# EAGLE design monojoystick-ioboard (EAGLE 5.06)

## Sheet 1 of 2
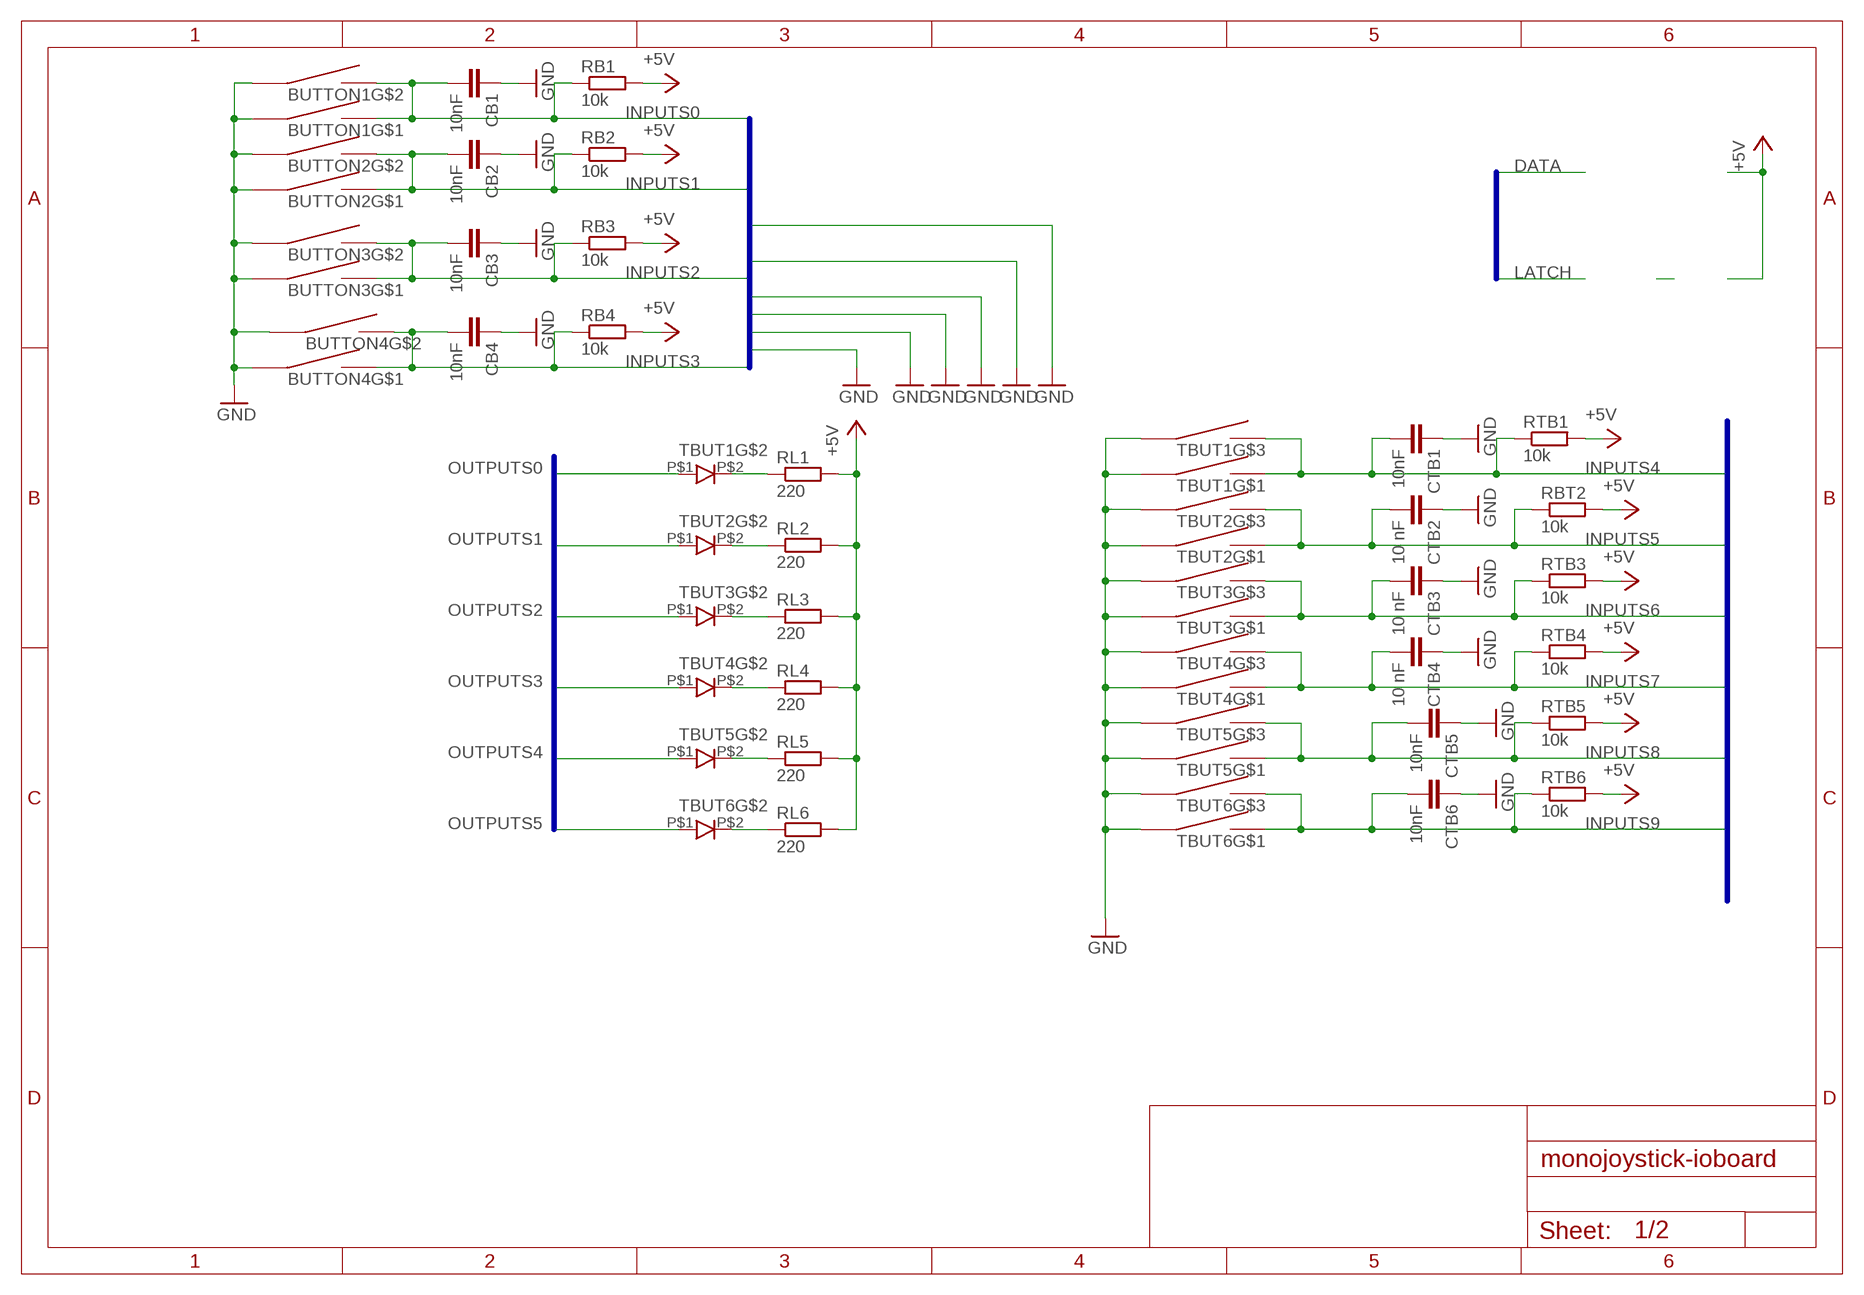
[diagram p0: schematic, sheet 1]

### Parts
BUTTON1  3FTL  [3FTL06]
BUTTON2  3FTL  [3FTL06]
BUTTON3  3FTL  [3FTL06]
BUTTON4  3FTL  [3FTL06]
CB1  10nF  C-EUC0805  [C0805]
CB2  10nF  C-EUC0805  [C0805]
CB3  10nF  C-EUC0805  [C0805]
CB4  10nF  C-EUC0805  [C0805]
CTB1  10nF  C-EUC0805  [C0805]
CTB2  10 nF  C-EUC0805  [C0805]
CTB3  10 nF  C-EUC0805  [C0805]
CTB4  10 nF  C-EUC0805  [C0805]
CTB5  10nF  C-EUC0805  [C0805]
CTB6  10nF  C-EUC0805  [C0805]
RB1  10k  R-EU_R0805  [R0805]
RB2  10k  R-EU_R0805  [R0805]
RB3  10k  R-EU_R0805  [R0805]
RB4  10k  R-EU_R0805  [R0805]
RBT2  10k  R-EU_R0805  [R0805]
RL1  220  R-EU_R0805  [R0805]
RL2  220  R-EU_R0805  [R0805]
RL3  220  R-EU_R0805  [R0805]
RL4  220  R-EU_R0805  [R0805]
RL5  220  R-EU_R0805  [R0805]
RL6  220  R-EU_R0805  [R0805]
RTB1  10k  R-EU_R0805  [R0805]
RTB3  10k  R-EU_R0805  [R0805]
RTB4  10k  R-EU_R0805  [R0805]
RTB5  10k  R-EU_R0805  [R0805]
RTB6  10k  R-EU_R0805  [R0805]
TBUT1  3FTL-LED  [3FTL06-LED]
TBUT2  3FTL-LED  [3FTL06-LED]
TBUT3  3FTL-LED  [3FTL06-LED]
TBUT4  3FTL-LED  [3FTL06-LED]
TBUT5  3FTL-LED  [3FTL06-LED]
TBUT6  3FTL-LED  [3FTL06-LED]

### Nets
GND: BUTTON1.A@1 BUTTON1.A@2 BUTTON2.A@1 BUTTON2.A@2 BUTTON3.A@1 BUTTON3.A@2 BUTTON4.A@1 BUTTON4.A@2 CB1.1 CB2.1 CB3.1 CB4.1 CTB1.1 CTB2.1 CTB3.1 CTB4.1 CTB5.1 CTB6.1 TBUT1.A@1 TBUT1.B@1 TBUT2.A@1 TBUT2.B@1 TBUT3.A@1 TBUT3.B@1 TBUT4.A@1 TBUT4.B@1 TBUT5.A@1 TBUT5.B@1 TBUT6.A@1 TBUT6.B@1 ; also sheet 2
INPUTS0: BUTTON1.B@1 BUTTON1.B@2 CB1.2 RB1.1 ; also sheet 2
INPUTS1: BUTTON2.B@1 BUTTON2.B@2 CB2.2 RB2.1 ; also sheet 2
INPUTS2: BUTTON3.B@1 BUTTON3.B@2 CB3.2 RB3.1 ; also sheet 2
INPUTS3: BUTTON4.B@1 BUTTON4.B@2 CB4.2 RB4.1 ; also sheet 2
INPUTS4: CTB1.2 RTB1.1 TBUT1.A@2 TBUT1.B@2 ; also sheet 2
INPUTS5: CTB2.2 RBT2.1 TBUT2.A@2 TBUT2.B@2 ; also sheet 2
INPUTS6: CTB3.2 RTB3.1 TBUT3.A@2 TBUT3.B@2 ; also sheet 2
INPUTS7: CTB4.2 RTB4.1 TBUT4.A@2 TBUT4.B@2 ; also sheet 2
INPUTS8: CTB5.2 RTB5.1 TBUT5.A@2 TBUT5.B@2 ; also sheet 2
INPUTS9: CTB6.2 RTB6.1 TBUT6.A@2 TBUT6.B@2 ; also sheet 2
N$6: RL5.1 TBUT5.P$2
N$7: RL4.1 TBUT4.P$2
N$8: RL6.1 TBUT6.P$2
N$9: RL1.1 TBUT1.P$2
N$10: RL2.1 TBUT2.P$2
N$11: RL3.1 TBUT3.P$2
OUTPUTS0: TBUT1.P$1 ; also sheet 2
OUTPUTS1: TBUT2.P$1 ; also sheet 2
OUTPUTS2: TBUT3.P$1 ; also sheet 2
OUTPUTS3: TBUT4.P$1 ; also sheet 2
OUTPUTS4: TBUT5.P$1 ; also sheet 2
OUTPUTS5: TBUT6.P$1 ; also sheet 2
VCC: RB1.2 RB2.2 RB3.2 RB4.2 RBT2.2 RL1.2 RL2.2 RL3.2 RL4.2 RL5.2 RL6.2 RTB1.2 RTB3.2 RTB4.2 RTB5.2 RTB6.2 ; supply symbol labelled +5V ; also sheet 2

### Buses
INPUTS[0..31]
LED1,LED2
OUTPUTS[0..8]

## Sheet 2 of 2
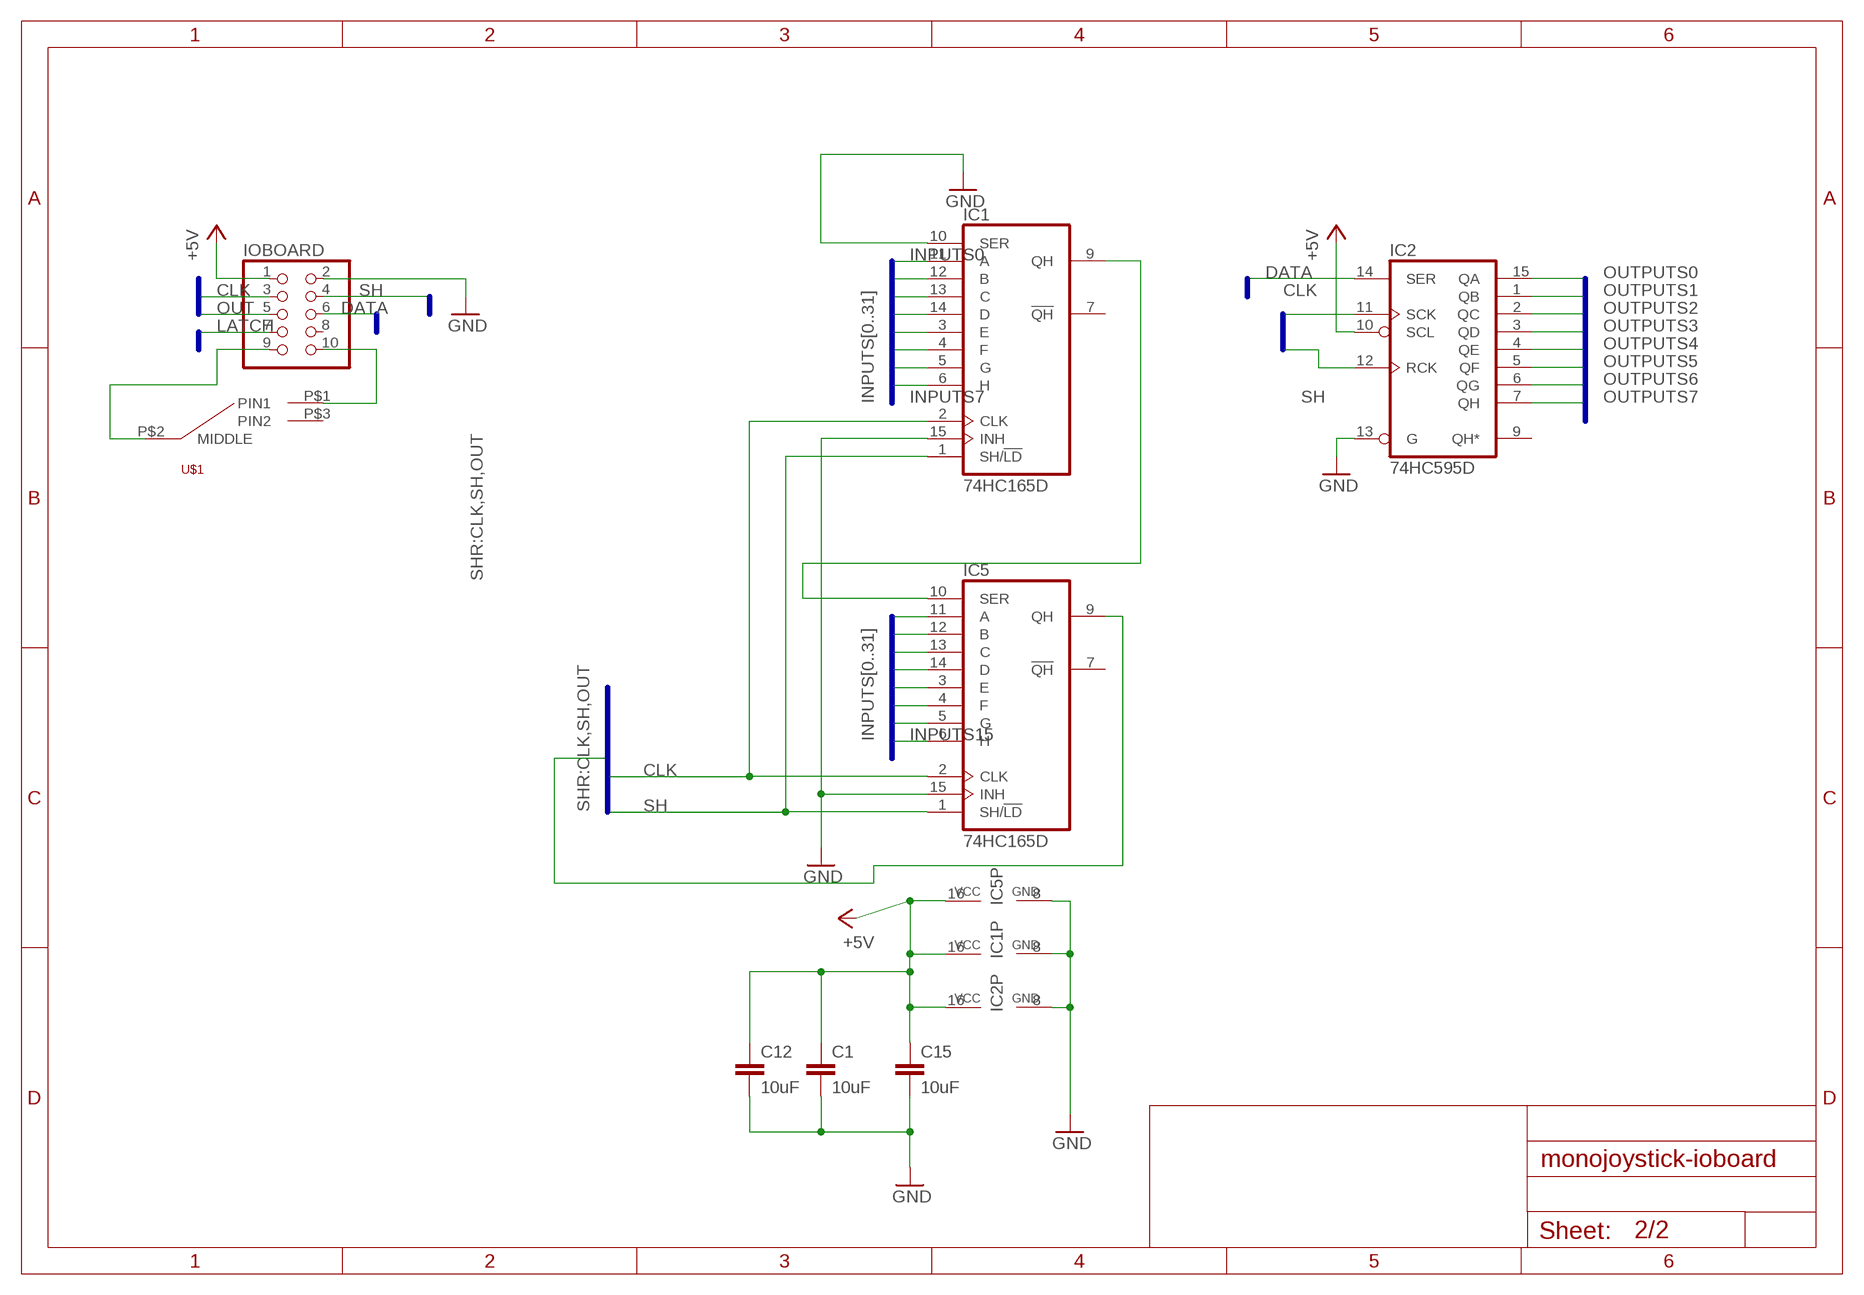
[diagram p1: schematic, sheet 2]

### Parts
C1  10uF  C-EUC0805  [C0805]
C12  10uF  C-EUC0805  [C0805]
C15  10uF  C-EUC0805  [C0805]
IC1  74HC165D  [SO16]
IC2  74HC595D  [SO16]
IC5  74HC165D  [SO16]
IOBOARD  PINHD-2X5  [2X05]
U$1  POWER  [POWER]

### Nets
CLK: IC1.2(CLK) IC2.11(SCK) IC5.2(CLK) IOBOARD.3
DATA: IC2.14(SER) IOBOARD.6 ; also sheet 1
GND: C1.2 C12.2 C15.2 IC1.8(GND) IC1.10(SER) IC1.15(INH) IC2.8(GND) IC2.13(G) IC5.8(GND) IC5.15(INH) IOBOARD.2 ; also sheet 1
INPUTS0: IC1.11(A) ; also sheet 1
INPUTS1: IC1.12(B) ; also sheet 1
INPUTS2: IC1.13(C) ; also sheet 1
INPUTS3: IC1.14(D) ; also sheet 1
INPUTS4: IC1.3(E) ; also sheet 1
INPUTS5: IC1.4(F) ; also sheet 1
INPUTS6: IC1.5(G) ; also sheet 1
INPUTS7: IC1.6(H) ; also sheet 1
INPUTS8: IC5.11(A) ; also sheet 1
INPUTS9: IC5.12(B) ; also sheet 1
INPUTS10: IC5.13(C)
INPUTS11: IC5.14(D)
INPUTS12: IC5.3(E)
INPUTS13: IC5.4(F)
INPUTS14: IC5.5(G)
INPUTS15: IC5.6(H) ; also sheet 1
LATCH: IOBOARD.7 ; also sheet 1
N$1: IC1.9(QH) IC5.10(SER)
N$4: IOBOARD.9 U$1.P$2(MIDDLE)
N$5: IOBOARD.10 U$1.P$1(PIN1)
OUT: IC5.9(QH) IOBOARD.5
OUTPUTS0: IC2.15(QA) ; also sheet 1
OUTPUTS1: IC2.1(QB) ; also sheet 1
OUTPUTS2: IC2.2(QC) ; also sheet 1
OUTPUTS3: IC2.3(QD) ; also sheet 1
OUTPUTS4: IC2.4(QE) ; also sheet 1
OUTPUTS5: IC2.5(QF) ; also sheet 1
OUTPUTS6: IC2.6(QG)
OUTPUTS7: IC2.7(QH)
SH: IC1.1(SH/!LD) IC2.12(RCK) IC5.1(SH/!LD) IOBOARD.4
VCC: C1.1 C12.1 C15.1 IC1.16(VCC) IC2.10(SCL) IC2.16(VCC) IC5.16(VCC) IOBOARD.1 ; supply symbol labelled +5V ; also sheet 1
Unconnected: IC1.7(!QH) IC2.9(QH*) IC5.7(!QH) IOBOARD.8 U$1.P$3(PIN2)

### Buses
INPUTS[0..31]
SHR:CLK,SH,OUT
LED1,LED2
OUTPUTS[0..8]

## Library data of the parts
BUTTON1-BUTTON4 = ruinwesen:3FTL; FRONTPLATE: yes; MECHANICAL: yes
C1 C12 C15 CB1-CB4 CTB1-CTB6 = rcl:C-EU: CAPACITOR, European symbol
IC1 IC5 = 74xx-eu:74*165: 8-bit parallel load SHIFT REGISTER
IC2 = 74xx-eu:74*595: 8-bit SHIFT REGISTER, output latch
IOBOARD = pinhead:PINHD-2X5: PIN HEADER
RB1-RB4 RBT2 RL1-RL6 RTB1 RTB3-RTB6 = rcl:R-EU_: RESISTOR, European symbol
TBUT1-TBUT6 = ruinwesen:3FTL-LED; FRONTPLATE: yes
U$1 = ruinwesen:POWER

## Board
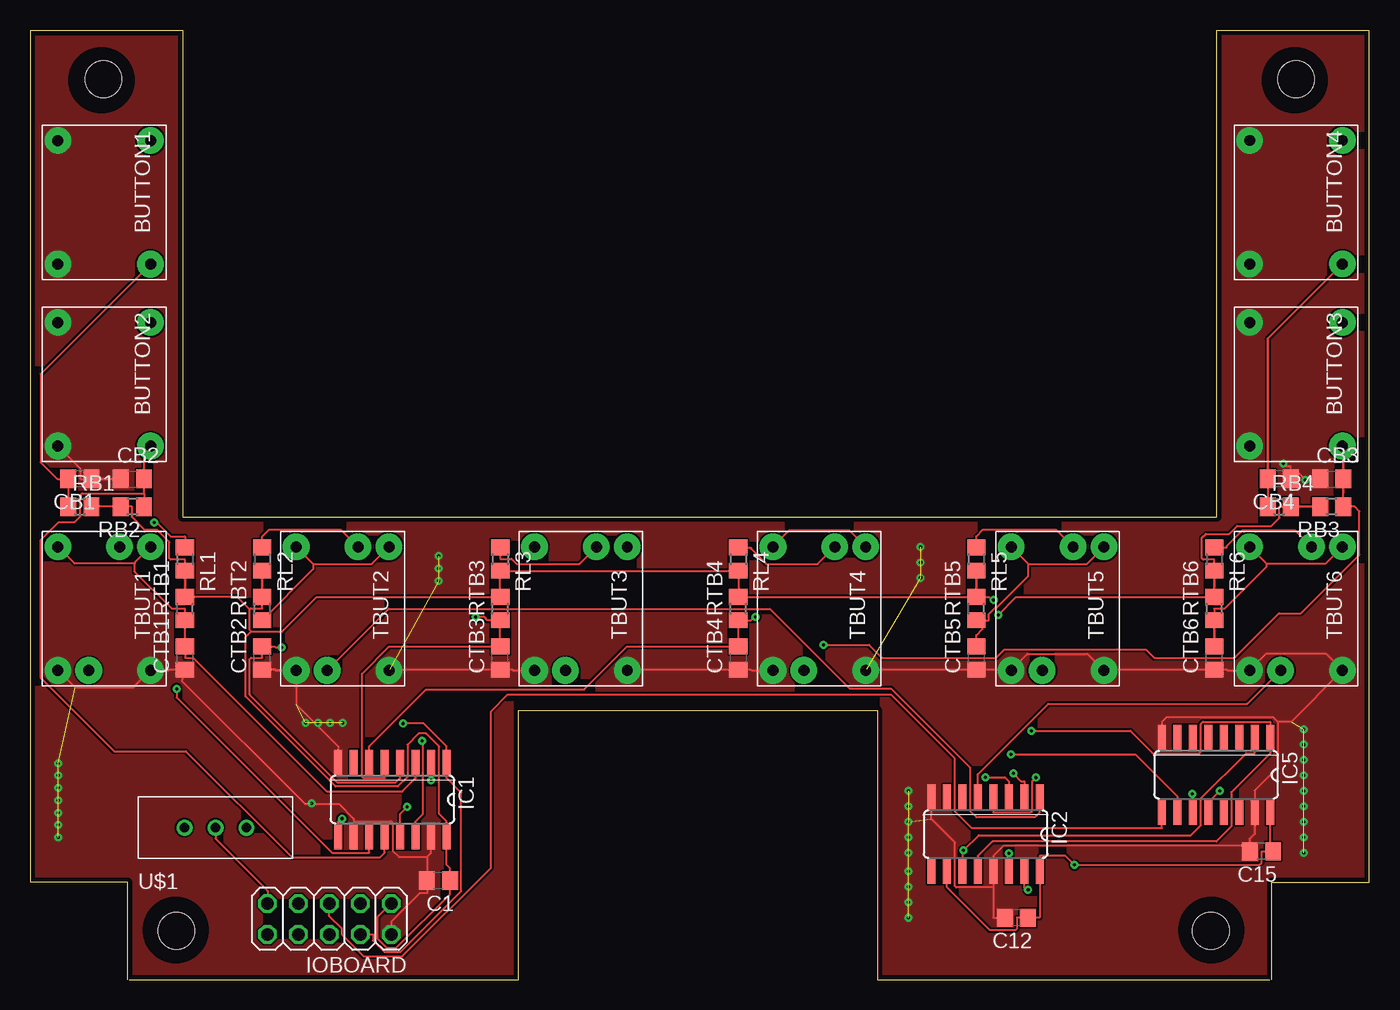
[diagram p2: board, top side]
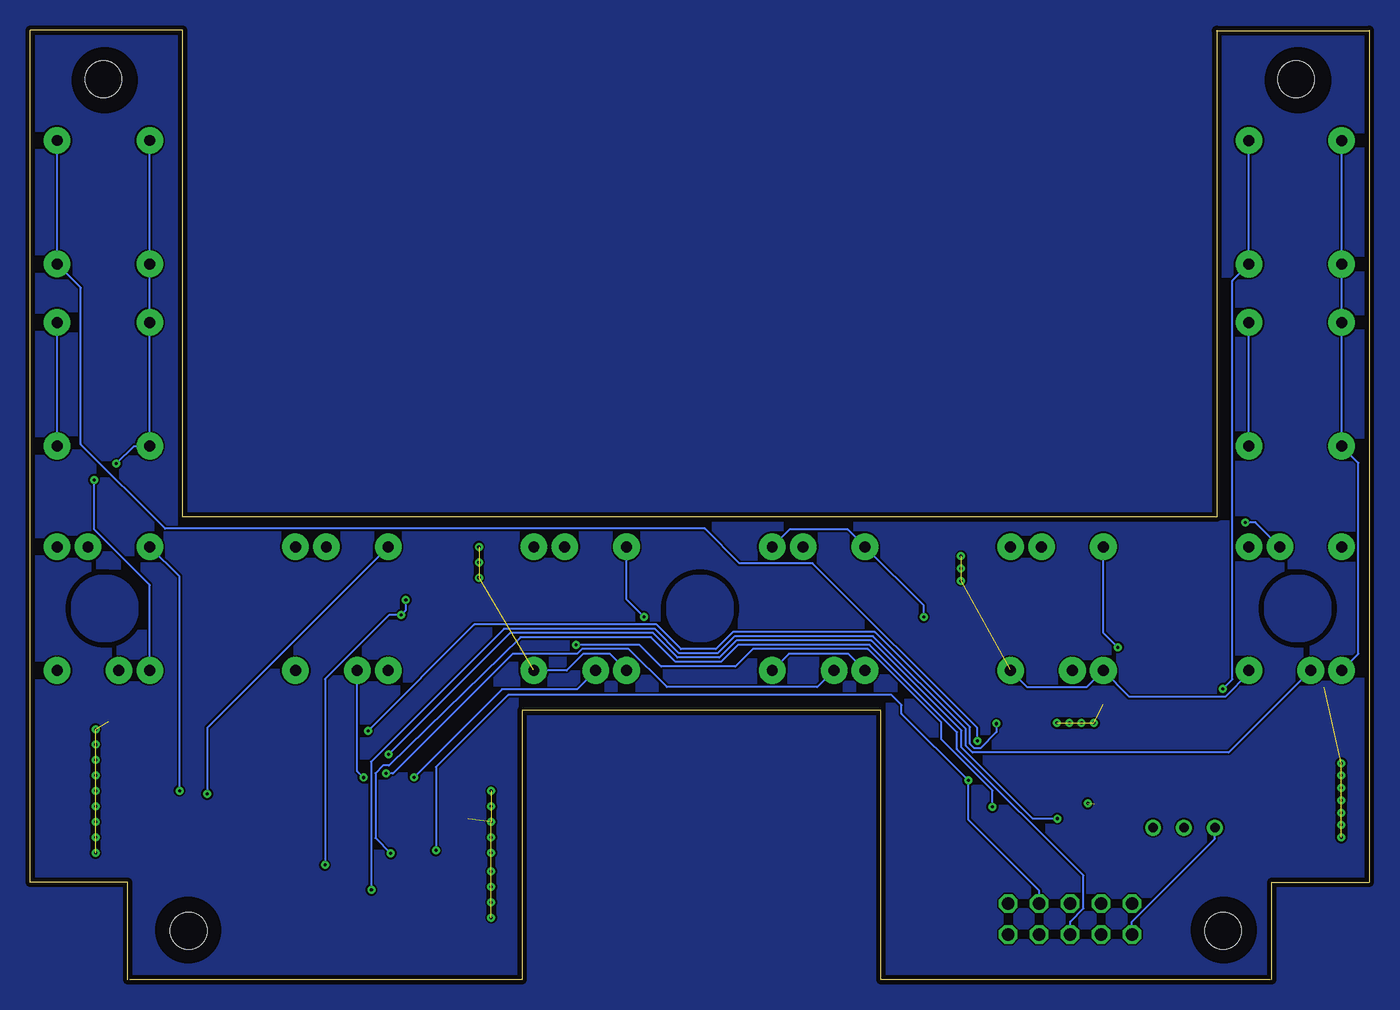
[diagram p3: board, bottom side, seen from below]

Size 110 x 78 mm. Coordinates in mm from the lower left corner, seen from the top.
Outline: 0,78 0,77.98
Outline: 0,77.98 0,8 8,8 8,0
Outline: 102,0 102,8 110,8 110,78 97.49,78 97.49,38.03 12.51,38.03 12.51,78
Outline: 12.55,77.98 0,77.98
Outline: 8.13,0 40.13,0 40.13,22.1 69.6,22.1 69.6,0 101.85,0
Copper layers (1*16): Top 0.035mm / dielectric 1.5mm / Bottom 0.035mm
Design rules "default *": minimum track width 0.15mm, minimum drill 0.25mm, track to track 0.15mm, track to pad 0.15mm, pad to pad 0.15mm, via to via 0.15mm, smd to smd 0.15mm, copper to edge 0.4mm, drill to drill 8mil, minimum pad ring 10mil, minimum via ring 8mil, stop-mask expansion 4mil, vias tented up to drill 0mil, thermal gap 10mil
Holes 3 mm at 6,74 104,74 12,4 97,4
tRestrict: area 9.4,1.5 to 14.5,6.6; area 94.5,1.5 to 99.5,6.6; area 101.4,71.4 to 106.4,76.4; area 3.3,71.4 to 8.4,76.4
bRestrict: area 9.4,1.5 to 14.5,6.6; area 2.8,27.5 to 8.8,33.5; area 94.5,1.5 to 99.5,6.6; area 100.9,27.5 to 106.9,33.5; area 101.4,71.4 to 106.4,76.4; area 3.3,71.4 to 8.4,76.4; area 52,27.5 to 58,33.5

### Footprints (pad centres in the part's own frame; a part is rotated, then mirrored left to right if it is on the bottom)
3FTL06 = drill 0.9 pad 2.184 round: A@1 -5.08,3.81; A@2 5.08,3.81; B@1 -5.08,-3.81; B@2 5.08,-3.81
C0805 = smd 1.3 x 1.5: 1 -0.95,0; 2 0.95,0
SO16 = smd 0.66 x 2.032: 1 -4.445,-3.073; 2 -3.175,-3.073; 3 -1.905,-3.073; 4 -0.635,-3.073; 5 0.635,-3.073; 6 1.905,-3.073; 7 3.175,-3.073; 8 4.445,-3.073; 9 4.445,3.073; 10 3.175,3.073; 11 1.905,3.073; 12 0.635,3.073; 13 -0.635,3.073; 14 -1.905,3.073; 15 -3.175,3.073; 16 -4.445,3.073
2X05 = drill 1.016 octagon: 1 -5.08,-1.27; 2 -5.08,1.27; 3 -2.54,-1.27; 4 -2.54,1.27; 5 0,-1.27; 6 0,1.27; 7 2.54,-1.27; 8 2.54,1.27; 9 5.08,-1.27; 10 5.08,1.27
R0805 = smd 1.3 x 1.5: 1 -0.95,0; 2 0.95,0
3FTL06-LED = drill 0.9 pad 2.184 round: A@1 -5.08,3.81; A@2 5.08,3.81; B@1 -5.08,-3.81; B@2 5.08,-3.81; P$1 -5.08,1.27; P$2 5.08,-1.27
POWER = drill 0.8 round: P$1 -2.54,0; P$2 0,0; P$3 2.54,0

### Placement (x,y rotation side)
BUTTON1  6.06,63.87 90 top
BUTTON2  6.06,48.92 90 top
BUTTON3  104,48.92 90 top
BUTTON4  104,63.88 90 top
C1  33.53,8.13 180 top
C12  81.03,5.08 180 top
C15  101.16,10.53 180 top
CB1  4.06,41.15 180 top
CB2  8.38,41.15 0 top
CB3  106.93,41.15 0 top
CB4  102.62,41.15 180 top
CTB1  12.7,26.42 90 top
CTB2  19.05,26.42 90 top
CTB3  38.61,26.42 90 top
CTB4  58.17,26.42 90 top
CTB5  77.72,26.42 90 top
CTB6  97.28,26.42 90 top
IC1  29.75,14.78 180 top
IC2  78.49,11.94 180 top
IC5  97.43,16.82 180 top
IOBOARD  24.56,4.98 180 top
RB1  4.06,38.86 0 top
RB2  8.38,38.86 180 top
RB3  106.93,38.86 180 top
RB4  102.62,38.86 0 top
RBT2  19.05,30.48 90 top
RL1  12.7,34.54 270 top
RL2  19.05,34.54 270 top
RL3  38.61,34.54 270 top
RL4  58.17,34.54 270 top
RL5  77.72,34.54 270 top
RL6  97.28,34.54 270 top
RTB1  12.7,30.48 90 top
RTB3  38.61,30.48 90 top
RTB4  58.17,30.48 90 top
RTB5  77.72,30.48 90 top
RTB6  97.28,30.48 90 top
TBUT1  6.06,30.48 90 top
TBUT2  25.65,30.48 90 top
TBUT3  45.24,30.48 90 top
TBUT4  64.82,30.48 90 top
TBUT5  84.41,30.48 90 top
TBUT6  104,30.48 90 top
U$1  15.21,12.48 0 top

### Tracks (layer width: path | path; a pad name or v marks a point on that pad's centre or on a via)
CLK  (via drill 0.25 pad 0.66)
  Top 0.15: IC5.2 100.61,18.6 99.9,18.6 96.19,14.89 96.19,12.68 95.37,11.85 77.92,11.85 v76.67,10.61 76.58,10.52 IC2.11 | v32.92,16.36 IC1.2
  Bottom 0.15: v76.67,10.61 76.67,17.46 70.75,23.39 39.24,23.39 38.41,22.56 38.41,21.84 v32.92,16.36 32.92,13.11 27.1,7.29 IOBOARD.3
DATA  (via drill 0.25 pad 0.66)
  Top 0.15: v80.39,10.38 IC2.14
  Bottom 0.15: v80.39,10.38 81.65,11.64 81.65,16.95 81.02,17.58 80.53,17.58 69.74,28.11 58.98,28.11 56.98,26.11 53.24,26.11 51.84,27.51 41.04,27.51 33.85,20.32 33.85,18.93 23.47,8.55 23.47,5.84 24.56,4.75 IOBOARD.6
GND  (via drill 0.25 pad 0.66)  (36 unrouted)
  Top 0.15: C12.2 79.15,5.08 79.12,5.11 79.12,7.57 | 79.12,7.57 76.07,7.57 75.98,7.67 75.98,11.26 74.04,13.2 IC2.8 | 100.21,10.68 100.21,10.65 99.86,11.01 79.97,11.01 79.12,10.16 IC2.13 79.12,7.57 | 102.48,21.18 102.13,21.54 93.34,21.54 92.99,21.18 IC5.8 | IOBOARD.2 29.64,4.75 32,7.1 32.58,7.1 C1.2 32.58,10.07 | 26.57,13 26.57,13.21 25.35,14.43 22.56,14.43 12.45,24.54 CTB1.1 11.42,25.47 11.36,25.4 TBUT1.B@1 8.46,23.99 3.66,23.99 TBUT1.A@1 | 32.58,10.07 30.28,10.07 29.78,10.58 29.78,12.85 29.62,13 26.57,13 | 32.58,10.07 32.92,10.42 IC1.15 | 26.57,13 IC1.10 | 103.57,41.66 104.17,41.66 v104.78,41.05 104.96,41.05 105.06,41.15 CB3.1 | 103.57,41.66 103.57,42.17 103.16,42.17 v102.94,42.39 | 103.57,41.66 CB4.1 | 102.48,21.18 103.59,21.18 TBUT6.B@1 106.42,26.79 101.58,26.79 TBUT6.A@1 98.37,25.4 98.31,25.47 CTB6.1 88.29,25.47 TBUT5.B@1 86.85,26.77 81.91,26.77 80.6,25.47 | 102.48,21.18 102.48,17.41 100.61,15.54 IC5.15 100.61,12.86 | 80.6,25.47 TBUT5.A@1 | 80.6,25.47 CTB5.1 68.7,25.47 TBUT4.B@1 | TBUT4.A@1 59.26,25.4 59.19,25.47 CTB4.1 49.11,25.47 TBUT3.B@1 | TBUT3.A@1 39.7,25.4 39.63,25.47 CTB3.1 29.52,25.47 TBUT2.B@1 | IC1.8 25.3,19.15 21.84,22.61 TBUT2.A@1 | 21.18,25.4 21,25.4 | CB1.1 4.09,41.15 4.09,42 BUTTON2.A@1
  Top 0.2: 100.21,10.65 C15.2 | 100.21,10.68 100.21,11.58 100.61,11.98 100.61,12.86 | CTB2.1 20.1,25.47 20.17,25.4 21,25.4 | TBUT2.A@1 21.18,25.4 | CB1.1 CB2.1
  Bottom 0.15: TBUT3.A@1 42.8,26.77 47.67,26.77 TBUT3.B@1 | TBUT4.A@1 62.38,26.77 64.57,26.77 65.94,25.4 TBUT4.B@1 | TBUT1.B@1 9.87,25.18 11.81,23.24 19.68,23.24 TBUT2.A@1 23.21,24.03 28.09,24.03 TBUT2.B@1 | TBUT6.A@1 100.19,32.41 104.78,37 v104.78,41.05 | v102.94,42.39 101.49,43.84 BUTTON3.A@1 BUTTON3.A@2 BUTTON4.A@1 BUTTON4.A@2 | BUTTON1.A@2 BUTTON1.A@1 BUTTON2.A@2 BUTTON2.A@1 0.88,42.47 0.88,26.77 TBUT1.A@1
  other vias: 33.53,34.8 33.53,33.78 33.53,32.77 23.11,14.48 25.65,21.08 24.64,21.08 23.62,21.08 23.62,21.08 22.61,21.08 2.29,17.78 2.29,16.76 2.29,15.75 2.29,14.73 2.29,13.72 2.29,12.7 2.29,11.68 73.15,35.56 73.15,34.29 73.15,33.02 72.14,15.49 72.14,14.22 72.14,12.95 72.14,11.68 72.14,10.41 72.14,8.89 72.14,7.62 72.14,6.35 72.14,5.08 104.65,20.57 104.65,19.3 104.65,18.03 104.65,16.76 104.65,15.49 104.65,14.22 104.65,12.95 104.65,11.68 104.65,10.41
  pour Top (isolate 0.001, no thermals): -2.29,78.99 111.76,78.99 111.76,-2.79 -2.29,-2.79
INPUTS0  (via drill 0.25 pad 0.66)
  Top 0.15: IC1.11 27.84,10.42 24.77,10.42 12.01,23.18 v12.01,23.89 | BUTTON1.B@1 0.84,49.76 0.84,42.5 2.19,41.15 CB1.2 RB1.1
  Bottom 0.15: v12.01,23.89 11.24,24.67 11.24,57.42 BUTTON1.B@1 BUTTON1.B@2
INPUTS1
  Top 0.15: 9.33,39.94 CB2.2 9.33,43.3 BUTTON2.B@1 | 9.33,39.94 RB2.1 | 9.33,39.94 4.28,39.94 4.09,39.76 4.09,38.04 3.63,37.59 2.35,37.59 0.86,36.1 0.86,24.79 6.88,18.76 12.78,18.76 21.5,10.04 28.74,10.04 29.11,10.42 IC1.12
  Bottom 0.15: BUTTON2.B@1 BUTTON2.B@2
INPUTS2  (via drill 0.25 pad 0.66)
  Top 0.15: RB3.1 108.81,38.86 109.2,38.47 109.2,34.9 104.4,30.11 102.59,30.11 98.93,26.44 92.36,26.44 91.67,27.13 80.04,27.13 79.35,26.44 69.98,26.44 68.91,27.51 v65.18,27.51 | v30.95,14.2 30.38,13.62 IC1.13 | 107.88,39.03 107.88,40.01
  Top 0.2: RB3.1 107.88,39.03 | 107.88,40.01 CB3.2 107.88,43.77 BUTTON3.B@1
  Bottom 0.15: v65.18,27.51 59.96,27.51 58.17,25.72 52.07,25.72 50.63,27.16 41.19,27.16 35.16,21.13 35.16,19.74 30.95,15.54 v30.95,14.2 | BUTTON3.B@1 BUTTON3.B@2
INPUTS3  (via drill 0.25 pad 0.66)
  Top 0.15: v32.2,19.62 32.26,19.55 32.26,13.61 31.65,13 IC1.14 | CB4.2 RB4.1
  Top 0.2: BUTTON4.B@1 101.67,52.66 CB4.2
  Bottom 0.15: v32.2,19.62 32.2,20.66 45.72,34.19 51.72,34.19 54.59,37.06 98.94,37.06 105.85,43.98 105.85,56.84 BUTTON4.B@1 BUTTON4.B@2
INPUTS4
  Top 0.15: IC1.3 31.65,16.57 30.55,15.46 24.35,15.46 13.37,26.44 12.7,26.44 CTB1.2 RTB1.1 12.7,30.45 11.63,30.45 8.58,33.5 8.58,34.18 | TBUT1.B@2 8.58,34.27 8.58,34.18 | 8.58,34.18 3.63,34.18 TBUT1.A@2
INPUTS5  (via drill 0.25 pad 0.66)
  Top 0.15: IC1.4 30.38,16.57 30.03,16.21 25.21,16.21 18.02,23.4 18.02,26.34 18.12,26.44 19.05,26.44 CTB2.2 20.07,27.37 20.14,27.3 v20.64,27.3 | TBUT2.A@2 23.25,34.15 | TBUT2.B@2 28.05,34.15 23.25,34.15 | 23.25,34.15 23.25,33.73 RBT2.1
  Bottom 0.15: TBUT2.A@2 21.84,28.5 v20.64,27.3
INPUTS6  (via drill 0.25 pad 0.66)
  Top 0.15: v36.59,29.8 37.31,29.8 37.58,29.53 RTB3.1 CTB3.2 29.49,27.37 27.24,25.12 27.24,16.7 27.37,16.57 29.11,16.57 IC1.5
  Bottom 0.15: v36.59,29.8 36.59,30.72 TBUT3.A@2 42.84,36.97 47.64,36.97 TBUT3.B@2
INPUTS7  (via drill 0.25 pad 0.66)
  Top 0.15: v59.59,29.8 59.46,29.8 59.19,29.53 RTB4.1 58.17,28.61 CTB4.2 57.14,27.37 49.04,27.37 45.51,23.84 32.53,23.84 27.84,19.15 IC1.6 | TBUT4.B@2 67.27,36.93 62.38,36.93 TBUT4.A@2
  Bottom 0.15: TBUT4.A@2 61.01,31.22 v59.59,29.8
INPUTS8  (via drill 0.25 pad 0.66)
  Top 0.15: CTB5.2 77.72,28.29 78.24,28.8 78.24,29.53 | 78.24,29.53 78.75,29.53 78.75,30.04 79.28,30.57 79.4,30.57 82,33.16 82,34.16 | 78.24,29.53 RTB5.1 | v95.47,15.26 95.53,15.2 IC5.11 | 82,34.16 TBUT5.A@2 | TBUT5.B@2 86.82,34.16 82,34.16
  Bottom 0.15: v95.47,15.26 95.47,20.69 TBUT5.A@2
INPUTS9  (via drill 0.25 pad 0.66)
  Top 0.15: RTB6.1 97.28,30.45 98.12,30.45 101.57,33.91 101.57,34.18 | TBUT6.A@2 101.57,34.18 | TBUT6.B@2 106.43,34.18 101.57,34.18 | v97.75,15.51 96.8,14.56 IC5.12
  Top 0.2: RTB6.1 CTB6.2
  Bottom 0.15: TBUT6.A@2 97.75,33.12 v97.75,15.51
N$1  (via drill 0.25 pad 0.66)
  Top 0.15: v80.55,18.49 90.81,18.49 94.26,15.04 IC5.10 | IC1.9 25.3,13 25.4,13 v25.62,13.22
  Bottom 0.15: v80.55,18.49 70.57,28.46 58.84,28.46 56.84,26.46 53.38,26.46 51.99,27.86 40.9,27.86 33.5,20.46 33.5,19.08 27.65,13.22 v25.62,13.22
N$2
  pour Bottom (isolate 0.001, no thermals): -5.33,81.03 -5.59,81.03 -5.59,-5.33 114.55,-5.33 114.55,81.28 -4.83,81.28 -4.83,81.53
N$4
  Top 0.15: IOBOARD.9 19.48,7.29 15.21,11.56 U$1.P$2
N$5
  Bottom 0.15: IOBOARD.10 19.48,4.75 12.67,11.56 U$1.P$1
N$6
  Top 0.15: RL5.1 77.72,36.42 78.27,36.97 84.27,36.97 TBUT5.P$2
N$7
  Top 0.15: RL4.1 59.19,35.49 59.19,35.42 60.47,34.14 64.67,34.14 TBUT4.P$2
N$8
  Top 0.15: RL6.1 98.31,35.49 98.31,35.62 99.61,36.93 103.9,36.93 TBUT6.P$2
N$9  (via drill 0.25 pad 0.66)
  Top 0.15: RL1.1 12.7,36.42 11.52,36.42 10.37,37.57 v10.15,37.57
  Bottom 0.15: TBUT1.P$2 9.34,37.57 v10.15,37.57
N$10
  Top 0.15: RL2.1 19.05,36.42 19.61,36.97 25.5,36.97 TBUT2.P$2
N$11
  Top 0.15: RL3.1 38.61,34.57 39.53,34.57 39.94,34.16 45.11,34.16 TBUT3.P$2
OUT
  Top 0.15: IC5.9 92.99,12.46 77.33,12.46 75.92,13.87 75.92,18.22 70.72,23.41 39.22,23.41 37.84,22.03 37.84,9.19 30.55,1.9 27.39,1.9 25.6,3.69 25.6,4.18 24.56,5.21 IOBOARD.5
OUTPUTS0  (via drill 0.25 pad 0.66)
  Top 0.15: IC2.15 81.66,7.57 81.78,7.57 v81.98,7.37
  Bottom 0.15: v81.98,7.37 82.01,7.39 82.01,17.9 71.09,28.82 58.69,28.82 56.69,26.81 53.53,26.81 52.13,28.21 40.75,28.21 33.15,20.61 33.15,19.22 32.59,18.66 11.53,18.66 TBUT1.P$1
OUTPUTS1
  Top 0.15: TBUT2.P$1 29.43,30.45 60.77,30.45 67.32,23.91 70.72,23.91 77.19,17.44 77.19,13.88 77.72,13.35 82.56,13.35 82.93,13.72 IC2.1
OUTPUTS2  (via drill 0.25 pad 0.66)
  Top 0.15: v80.77,16.94 81.4,16.3 81.66,16.3 IC2.2
  Bottom 0.15: TBUT3.P$1 45.33,24.03 57.71,24.03 60.84,27.16 64.67,27.16 65.06,26.77 70.38,26.77 80.22,16.94 v80.77,16.94
OUTPUTS3  (via drill 0.25 pad 0.66)
  Top 0.15: IC2.3 80.39,16.3 80.07,16.62 v78.48,16.62
  Bottom 0.15: TBUT4.P$1 65.1,23.85 71.25,23.85 v78.48,16.62
OUTPUTS4  (via drill 0.25 pad 0.66)
  Top 0.15: v82.61,16.59 82.33,16.3 82.33,13.88 82.16,13.72 79.12,13.72 IC2.4
  Bottom 0.15: TBUT5.P$1 83.14,17.12 v82.61,16.59
OUTPUTS5
  Top 0.15: TBUT6.P$1 99.99,22.66 83.64,22.66 77.85,16.88 IC2.5
SH  (via drill 0.25 pad 0.66)
  Top 0.15: v30.62,21.03 32.31,21.03 34.19,19.15 IC1.1 34.19,16.57 35.4,15.35 35.4,7.25 30.42,2.26 29.1,2.26 28.14,3.22 28.14,3.71 IOBOARD.4 | v82.27,20.44 90.39,20.44 92.22,18.6 96.04,18.6 96.19,18.75 96.19,21.02 96.35,21.18 101.88,21.18 IC5.1 101.88,19.25 101.88,18.6 98.67,15.4 98.67,12.57 97.45,11.36 79.05,11.36 77.85,10.16 IC2.12
  Bottom 0.15: v82.27,20.44 73.54,29.17 58.55,29.17 56.55,27.16 53.67,27.16 52.28,28.56 40.6,28.56 32.8,20.75 32.8,19.37 32.45,19.01 31.95,19.01 30.62,20.34 v30.62,21.03
VCC  (via drill 0.25 pad 0.66)
  Top 0.15: 18.14,28.6 20.7,28.6 23.54,31.43 RTB3.2 RL3.2 RL4.2 58.17,31.51 | IOBOARD.1 28.55,5.16 28.55,3.34 29.27,2.61 30.07,2.61 34.48,7.02 C1.1 34.48,9.15 34.19,9.44 IC1.16 34.19,13 33.59,13.61 33.59,19.14 32.51,20.22 31.91,20.22 30.99,19.3 30.99,16.67 30.18,15.86 25.07,15.86 17.68,23.25 17.68,28.14 18.14,28.6 | RL1.2 12.7,34.52 11.52,34.52 11.42,34.62 11.42,35.95 10.41,36.96 9.4,36.96 8.36,38.01 8.36,38.86 RB2.2 RB1.2 | 12.7,32.51 12.7,32.6 | 18.14,28.6 18.02,28.71 18.02,30.41 | 101.65,10.53 101.88,10.76 IC5.16 | 101.65,10.53 101.18,10.53 101.18,9.6 101,9.42 v85.79,9.42 85.06,10.16 82.93,10.16 IC2.16 82.93,5.11 82.9,5.08 C12.1 81.05,5.08 81.05,4.16 80.95,4.05 78.83,4.05 75.31,7.57 IC2.10 | 101.65,10.53 C15.1 | RTB6.2 81,31.43 v79.53,29.96 | v79.15,31.19 78.99,31.19 78.75,31.43 RTB5.2 58.24,31.43 58.17,31.51 | 58.17,31.51 RTB4.2 | 18.02,30.41 18.12,30.5 19.05,30.5 RBT2.2 | RTB1.2 17,31.43 18.02,30.41 | RL6.2 97.28,34.52 96.36,34.52 96.26,34.62 96.26,36.31 96.56,36.62 98.5,36.62 99.16,37.28 101.98,37.28 102.64,37.94 102.64,38.86 RB4.2
  Top 0.2: 12.7,32.6 RL1.2 | RTB1.2 12.7,32.51 | RTB6.2 RL6.2 | RTB5.2 RL5.2 | RBT2.2 RL2.2 | RB4.2 RB3.2
  Bottom 0.15: v85.79,9.42 85.79,24.69 80.52,29.96 v79.53,29.96 79.15,30.34 v79.15,31.19